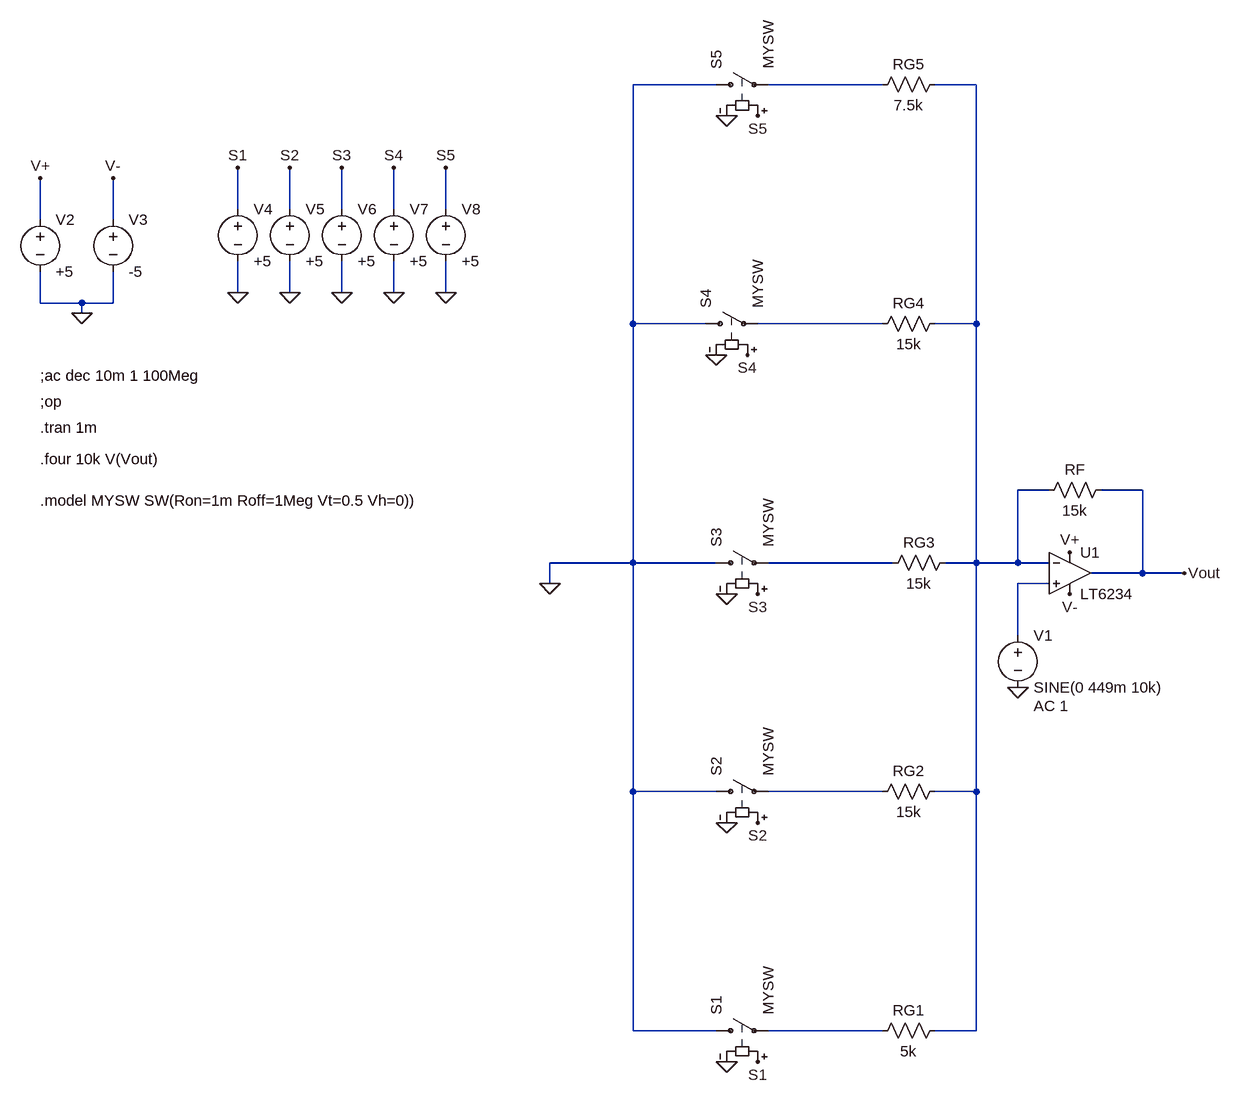
[diagram p0: schematic ETAJUL3_PGA.asc]
ETAJUL3_PGA.asc, the LTspice schematic file:
Version 4
SHEET 1 1128 1184
WIRE -336 -576 -464 -576
WIRE -80 -576 -256 -576
WIRE 64 -576 0 -576
WIRE -1072 -384 -1072 -448
WIRE -992 -384 -992 -448
WIRE -912 -384 -912 -448
WIRE -832 -384 -832 -448
WIRE -752 -384 -752 -448
WIRE -1376 -368 -1376 -432
WIRE -1264 -368 -1264 -432
WIRE -1072 -256 -1072 -304
WIRE -992 -256 -992 -304
WIRE -912 -256 -912 -304
WIRE -832 -256 -832 -304
WIRE -752 -256 -752 -304
WIRE -1376 -240 -1376 -288
WIRE -1312 -240 -1376 -240
WIRE -1264 -240 -1264 -288
WIRE -1264 -240 -1312 -240
WIRE -1312 -224 -1312 -240
WIRE -464 -208 -464 -576
WIRE -352 -208 -464 -208
WIRE -80 -208 -272 -208
WIRE 64 -208 64 -576
WIRE 64 -208 0 -208
WIRE 176 48 128 48
WIRE 320 48 256 48
WIRE -464 160 -464 -208
WIRE -464 160 -592 160
WIRE -336 160 -464 160
WIRE -64 160 -256 160
WIRE 64 160 64 -208
WIRE 64 160 16 160
WIRE 128 160 128 48
WIRE 128 160 64 160
WIRE 176 160 128 160
WIRE 320 176 320 48
WIRE 320 176 240 176
WIRE 384 176 320 176
WIRE -592 192 -592 160
WIRE 176 192 128 192
WIRE 128 272 128 192
WIRE -464 512 -464 160
WIRE -336 512 -464 512
WIRE -80 512 -256 512
WIRE 64 512 64 160
WIRE 64 512 0 512
WIRE -464 880 -464 512
WIRE -336 880 -464 880
WIRE -80 880 -256 880
WIRE 64 880 64 512
WIRE 64 880 0 880
FLAG 128 352 0
FLAG -1312 -224 0
FLAG -1072 -256 0
FLAG -992 -256 0
FLAG -912 -256 0
FLAG -832 -256 0
FLAG -752 -256 0
FLAG -1072 -448 S1
FLAG -992 -448 S2
FLAG -912 -448 S3
FLAG -832 -448 S4
FLAG -752 -448 S5
FLAG -592 192 0
FLAG -320 -528 0
FLAG -272 -528 S5
FLAG -336 -160 0
FLAG -320 208 0
FLAG -320 560 0
FLAG -320 928 0
FLAG -288 -160 S4
FLAG -272 208 S3
FLAG -272 560 S2
FLAG -272 928 S1
FLAG -1376 -432 V+
FLAG 208 144 V+
FLAG -1264 -432 V-
FLAG 208 208 V-
FLAG 384 176 Vout
SYMBOL voltage 128 256 R0
WINDOW 123 24 124 Left 2
WINDOW 39 0 0 Left 0
SYMATTR Value2 AC 1
SYMATTR InstName V1
SYMATTR Value SINE(0 449m 10k)
SYMBOL res 272 32 R90
WINDOW 0 0 56 VBottom 2
WINDOW 3 32 56 VTop 2
SYMATTR InstName RF
SYMATTR Value 15k
SYMBOL res 32 144 R90
WINDOW 0 0 56 VBottom 2
WINDOW 3 32 56 VTop 2
SYMATTR InstName RG3
SYMATTR Value 15k
SYMBOL res 16 -224 R90
WINDOW 0 0 56 VBottom 2
WINDOW 3 32 56 VTop 2
SYMATTR InstName RG4
SYMATTR Value 15k
SYMBOL res 16 -592 R90
WINDOW 0 0 56 VBottom 2
WINDOW 3 32 56 VTop 2
SYMATTR InstName RG5
SYMATTR Value 7.5k
SYMBOL res 16 864 R90
WINDOW 0 0 56 VBottom 2
WINDOW 3 32 56 VTop 2
SYMATTR InstName RG1
SYMATTR Value 5k
SYMBOL res 16 496 R90
WINDOW 0 0 56 VBottom 2
WINDOW 3 32 56 VTop 2
SYMATTR InstName RG2
SYMATTR Value 15k
SYMBOL sw -352 -576 R270
SYMATTR InstName S5
SYMATTR Value MYSW
SYMBOL sw -368 -208 R270
SYMATTR InstName S4
SYMATTR Value MYSW
SYMBOL sw -352 160 R270
SYMATTR InstName S3
SYMATTR Value MYSW
SYMBOL sw -352 512 R270
SYMATTR InstName S2
SYMATTR Value MYSW
SYMBOL sw -352 880 R270
SYMATTR InstName S1
SYMATTR Value MYSW
SYMBOL OpAmps\\LT6234 208 176 R0
SYMATTR InstName U1
SYMBOL voltage -1376 -384 R0
SYMATTR InstName V2
SYMATTR Value +5
SYMBOL voltage -1264 -384 R0
SYMATTR InstName V3
SYMATTR Value -5
SYMBOL voltage -1072 -400 R0
SYMATTR InstName V4
SYMATTR Value +5
SYMBOL voltage -992 -400 R0
WINDOW 123 0 0 Left 0
WINDOW 39 0 0 Left 0
SYMATTR InstName V5
SYMATTR Value +5
SYMBOL voltage -912 -400 R0
WINDOW 123 0 0 Left 0
WINDOW 39 0 0 Left 0
SYMATTR InstName V6
SYMATTR Value +5
SYMBOL voltage -832 -400 R0
WINDOW 123 0 0 Left 0
WINDOW 39 0 0 Left 0
SYMATTR InstName V7
SYMATTR Value +5
SYMBOL voltage -752 -400 R0
WINDOW 123 0 0 Left 0
WINDOW 39 0 0 Left 0
SYMATTR InstName V8
SYMATTR Value +5
TEXT -1376 -48 Left 2 !.tran 1m
TEXT -1376 -128 Left 2 !;ac dec 10m 1 100Meg
TEXT -1376 -88 Left 2 !;op
TEXT -1376 64 Left 2 !.model MYSW SW(Ron=1m Roff=1Meg Vt=0.5 Vh=0))
TEXT -1376 0 Left 2 !.four 10k V(Vout)

The netlist it stands for:
* ETAJUL3_PGA.asc
V1 N005 0 SINE(0 449m 10k) AC 1
RF Vout N002 15k
RG3 N002 N004 15k
RG4 N002 N003 15k
RG5 N002 N001 7.5k
RG1 N002 N007 5k
RG2 N002 N006 15k
S5 0 N001 S5 0 MYSW
S4 0 N003 S4 0 MYSW
S3 0 N004 S3 0 MYSW
S2 0 N006 S2 0 MYSW
S1 0 N007 S1 0 MYSW
* U1: LT6234 (symbol OpAmps\LT6234 not available, pins judged from their places): In+=N005 In-=N002 V+=V+ V-=V- OUT=Vout
V2 V+ 0 +5
V3 V- 0 -5
V4 S1 0 +5
V5 S2 0 +5
V6 S3 0 +5
V7 S4 0 +5
V8 S5 0 +5
.tran 1m
;ac dec 10m 1 100Meg
;op
.model MYSW SW(Ron=1m Roff=1Meg Vt=0.5 Vh=0))
.four 10k V(Vout)
.backanno
.end